# Altium schematic sheet LT3042_3V3.SchDoc
size A4; SheetNumber: 8; SheetTotal: 27
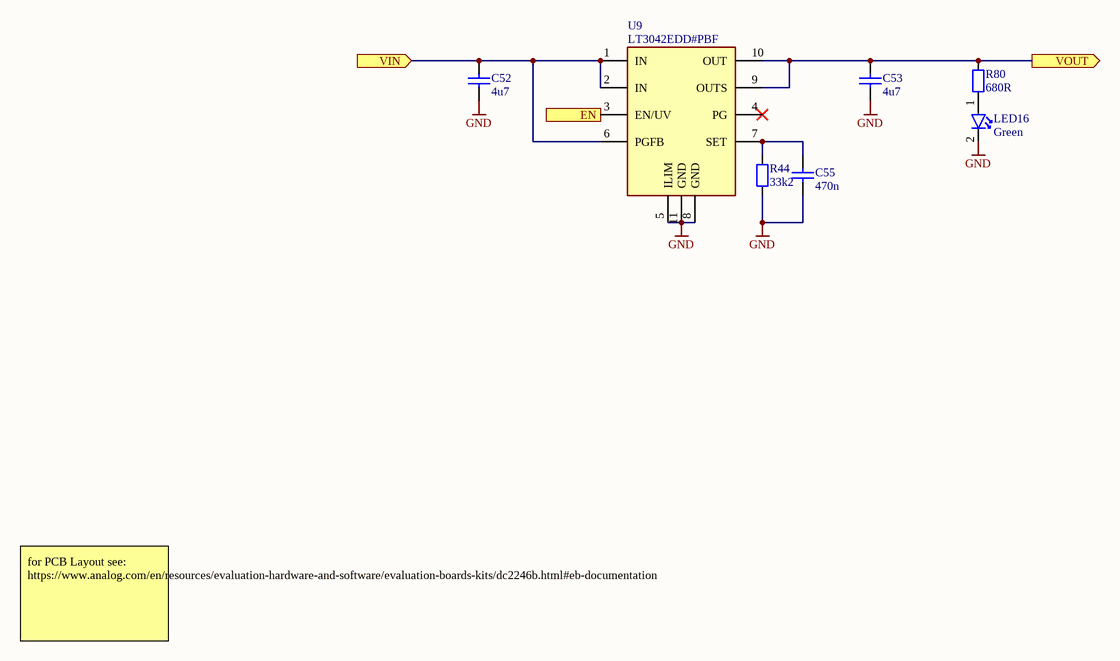
[diagram p0: LT3042_3V3.SchDoc]

## Parts
C52  4u7  [C_1206_3216Metric_IPC_N]
C53  4u7  [C_1206_3216Metric_IPC_N]
C55  470n  [C_0402_1005Metric_IPC_N]
LED16  Green  [LED_0603_1806Metric_IPC_N]
R44  33k2  [R_0402_1005Metric_IPC_N]
R80  680R  [R_0402_1005Metric_IPC_N]
U9  LT3042EDD#PBF  [DFN10_3x3]

## Ports
EN (in, see Power_Supply[5B]), VIN (in, see Power_Supply[5B], LT3045_3V3[2B], TLV755P_3V3[2B], XC6204_1V8[2B]), VOUT (out, see Power_Supply[6B])

## Nets
GND: C52.1 C53.1 C55.1 LED16.2 R44.1 U9.5(ILIM) U9.8(GND) U9.11(GND)
EN: U9.3(EN/UV) ; port EN
VIN: C52.2 U9.1(IN) U9.2(IN) U9.6(PGFB) ; port VIN
VOUT: C53.2 R80.1 U9.9(OUTS) U9.10(OUT) ; port VOUT
NetC55_2: C55.2 R44.2 U9.7(SET)
NetLED16_1: LED16.1 R80.2

Not connected (* = marked no-connect by the designer): U9 4(PG)*

## Notes on the sheet
- for PCB Layout see:
  https://www.analog.com/en/resources/evaluation-hardware-and-software/evaluation-boards-kits/dc2246b.html#eb-documentation

## Library data of the parts
C52 C53 = C000005: Generic MLCC with 1206 Footprint; Specific Component: False; Temp Coefficient: X7R; Voltage Rated: 15V; ID: C000005; Capacitance: 4u7; Tolerance: *; min Temperature: *; max Temperature: *; Case: 1206
C55 = C000002: Generic MLCC with 0402 Footprint; Specific Component: False; Temp Coefficient: X7R; ID: C000002; Capacitance: 470n; Tolerance: *; Voltage Rated: *; min Temperature: *; max Temperature: *; Case: 0402
LED16 = LED000007: MLCC, Low Current, Green, 2.2V, 20mA, 0603; Manufacturer: Broadcom / Avago; Manufacturer Part Number: HSMG-C190; Specific Component: True; ID: LED000007; Type: Low Current; Colour: Green; Forward Voltage: 2.2V; Current: 20mA; Case: 0603; ComponentLink1Description: Datasheet; ComponentLink1URL: https://www.mouser.de/datasheet/3/57/1/AV02_0551EN_DS_HSMx_Cxxx_25Mar2022.pdf; Supplier 1: Mouser; Supplier Part Number 1: 630-HSMG-C190; Supplier 2: Digikey; Supplier Part Number 2: 516-1425-1-ND
R44 R80 = R000002: Generic Chip Resistor with 0402 Footprint; Specific Component: False; ID: R000002; Tolerance: *; Power Rating: *; Composition: *; min Temperature: *; max Temperature: *; Temp Coefficient: *; Case: 0402
  R44: Resistance: 33k2
  R80: Resistance: 680R
U9 = PMIC000029: Manufacturer: Analog Devices; ID: PMIC000029; Type: LDO; Manufacturer Part Number: LT3042EDD#PBF; Part Value: LT3042EDD#PBF; Case: 10-DFN (3x3); ComponentLink1Description: Datasheet; ComponentLink1URL: https://www.analog.com/media/en/technical-documentation/data-sheets/lt3042.pdf; Supplier 1: Digikey; Supplier Part Number 1: 505-LT3042EDD#PBF-ND; Supplier 2: Mouser; Supplier Part Number 2: 584-LT3042EDD#PBF